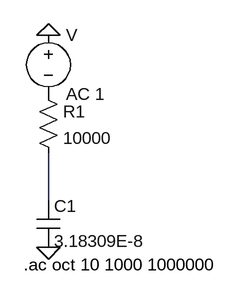
[diagram p0: schematic Draft1.asc]
Draft1.asc, the LTspice schematic file:
Version 4
SHEET 1 880 680
WIRE 192 224 192 160
FLAG 192 288 0
FLAG 192 0 0
SYMBOL res 176 64 R0
SYMATTR InstName R1
SYMATTR Value 10000
SYMBOL cap 176 224 R0
SYMATTR InstName C1
SYMATTR Value 3.18309E-8
SYMBOL voltage 192 -16 R0
WINDOW 123 0 0 Left 0
WINDOW 39 0 0 Left 0
SYMATTR InstName V
SYMATTR Value AC 1
TEXT 158 312 Left 2 !.ac oct 10 1000 1000000

The netlist it stands for:
* Draft1.asc
R1 P001 N001 10000
C1 N001 0 3.18309E-8
V 0 P001 AC 1
.ac oct 10 1000 1000000
.backanno
.end